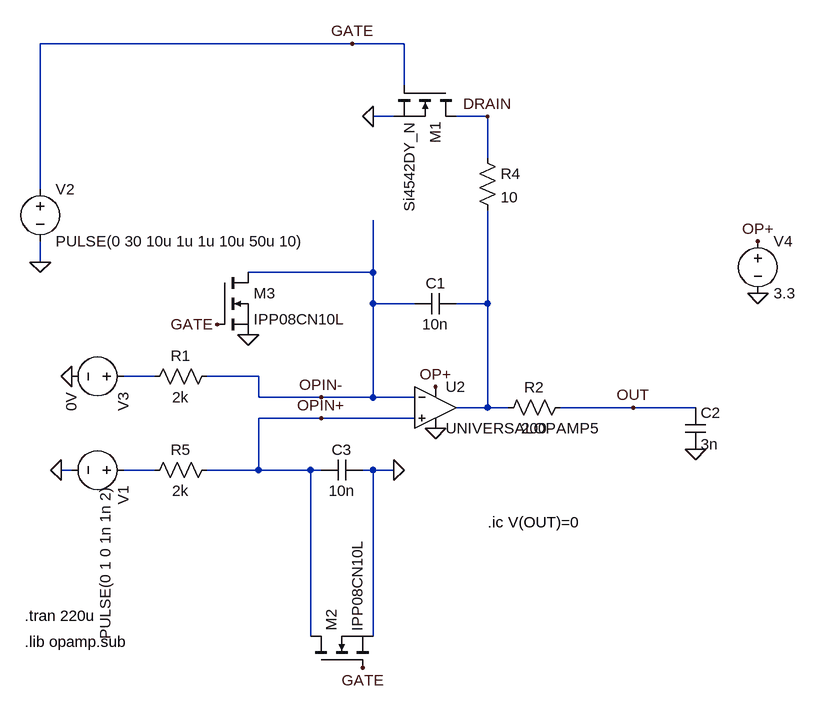
[diagram p0: schematic gain-filter-current-dac.asc]
gain-filter-current-dac.asc, the LTspice schematic file:
Version 4.1
SHEET 1 1308 680
WIRE 32 -560 -448 -560
WIRE 112 -560 32 -560
WIRE 112 -496 112 -560
WIRE 96 -448 64 -448
WIRE 240 -448 192 -448
WIRE 240 -384 240 -448
WIRE -448 -336 -448 -560
WIRE -448 -224 -448 -256
WIRE 64 -208 64 -288
WIRE 64 -208 -128 -208
WIRE 64 -160 64 -208
WIRE 128 -160 64 -160
WIRE 240 -160 240 -304
WIRE 240 -160 192 -160
WIRE -272 -48 -320 -48
WIRE -112 -48 -192 -48
WIRE -112 -16 -112 -48
WIRE -16 -16 -112 -16
WIRE 64 -16 64 -160
WIRE 64 -16 -16 -16
WIRE 128 -16 64 -16
WIRE 240 0 240 -160
WIRE 240 0 192 0
WIRE 272 0 240 0
WIRE 464 0 352 0
WIRE 560 0 464 0
WIRE -16 16 -112 16
WIRE 128 16 -16 16
WIRE -400 96 -416 96
WIRE -272 96 -320 96
WIRE -112 96 -112 16
WIRE -112 96 -192 96
WIRE -32 96 -112 96
WIRE -16 96 -32 96
WIRE 64 96 48 96
WIRE 96 96 64 96
WIRE -32 352 -32 96
WIRE 64 352 64 96
FLAG -416 96 0
FLAG 560 64 0
FLAG -400 -48 0
FLAG 464 0 OUT
FLAG 32 -560 GATE
FLAG 240 -448 DRAIN
FLAG -448 -224 0
FLAG 656 -176 0
FLAG 656 -256 OP+
FLAG 160 32 0
FLAG 160 -32 OP+
FLAG 96 96 0
FLAG 48 400 GATE
FLAG 64 -448 0
FLAG -16 -16 OPIN-
FLAG -16 16 OPIN+
FLAG -176 -128 GATE
FLAG -128 -112 0
SYMBOL voltage -304 96 R90
WINDOW 123 0 0 Left 0
WINDOW 39 0 0 Left 0
WINDOW 3 24 44 Left 2
SYMATTR Value PULSE(0 1 0 1n 1n 2)
SYMATTR InstName V1
SYMBOL res -288 -32 R270
WINDOW 0 32 56 VTop 2
WINDOW 3 0 56 VBottom 2
SYMATTR InstName R1
SYMATTR Value 2k
SYMBOL cap 192 -176 R90
WINDOW 0 0 32 VBottom 2
WINDOW 3 32 32 VTop 2
SYMATTR InstName C1
SYMATTR Value 10n
SYMBOL cap 544 0 R0
SYMATTR InstName C2
SYMATTR Value 3n
SYMBOL res 368 -16 R90
WINDOW 0 0 56 VBottom 2
WINDOW 3 32 56 VTop 2
SYMATTR InstName R2
SYMATTR Value 200
SYMBOL nmos 192 -496 R90
SYMATTR InstName M1
SYMATTR Value Si4542DY_N
SYMBOL voltage -448 -352 R0
WINDOW 123 0 0 Left 0
WINDOW 39 0 0 Left 0
SYMATTR InstName V2
SYMATTR Value PULSE(0 30 10u 1u 1u 10u 50u 10)
SYMBOL voltage -304 -48 R90
WINDOW 123 0 0 Left 0
WINDOW 39 0 0 Left 0
SYMATTR InstName V3
SYMATTR Value 0V
SYMBOL res 224 -400 R0
SYMATTR InstName R4
SYMATTR Value 10
SYMBOL voltage 656 -272 R0
WINDOW 123 0 0 Left 0
WINDOW 39 0 0 Left 0
SYMATTR InstName V4
SYMATTR Value 3.3
SYMBOL OpAmps\\UniversalOpAmp5 160 0 R0
SYMATTR InstName U2
SYMBOL res -176 80 R90
WINDOW 0 0 56 VBottom 2
WINDOW 3 32 56 VTop 2
SYMATTR InstName R5
SYMATTR Value 2k
SYMBOL cap 48 80 R90
WINDOW 0 0 32 VBottom 2
WINDOW 3 32 32 VTop 2
SYMATTR InstName C3
SYMATTR Value 10n
SYMBOL nmos -32 400 R270
SYMATTR InstName M2
SYMATTR Value IPP08CN10L
SYMBOL nmos -176 -208 R0
SYMATTR InstName M3
SYMATTR Value IPP08CN10L
TEXT -472 320 Left 2 !.tran 220u
TEXT -472 360 Left 2 !.lib opamp.sub
TEXT 240 176 Left 2 !.ic V(OUT)=0

The netlist it stands for:
* gain-filter-current-dac.asc
V1 N003 0 PULSE(0 1 0 1n 1n 2)
R1 N002 OPIN- 2k
C1 N001 OPIN- 10n
C2 OUT 0 3n
R2 OUT N001 200
M1 DRAIN GATE 0 0 Si4542DY_N
V2 GATE 0 PULSE(0 30 10u 1u 1u 10u 50u 10)
V3 N002 0 0V
R4 DRAIN N001 10
V4 OP+ 0 3.3
X§U2 OPIN+ OPIN- OP+ 0 N001 level5 Avol=1Meg GBW=10Meg Phimargin=45 SlewPos=10Meg SlewNeg=10Meg En=0 Enk=0 In=0 Ink=0 Rcm=500Meg Ccm=1p Rdiff=500k Cdiff=2p Ro=1k Vos=0 Ibp=2n Ibn=1n Iq=1m Rail=0 Ilimit=25m  ; UNIVERSALOPAMP5, pins In+ In- V+ V- OUT
R5 OPIN+ N003 2k
C3 0 OPIN+ 10n
M2 OPIN+ GATE 0 0 IPP08CN10L
M3 OPIN- GATE 0 0 IPP08CN10L
.model NMOS NMOS
.model PMOS PMOS
.lib standard.mos
.tran 220u
.lib opamp.sub
.ic V(OUT)=0
.backanno
.end